# EasyEDA Pro project ProPrj_主车电路板.epro, board PCB1
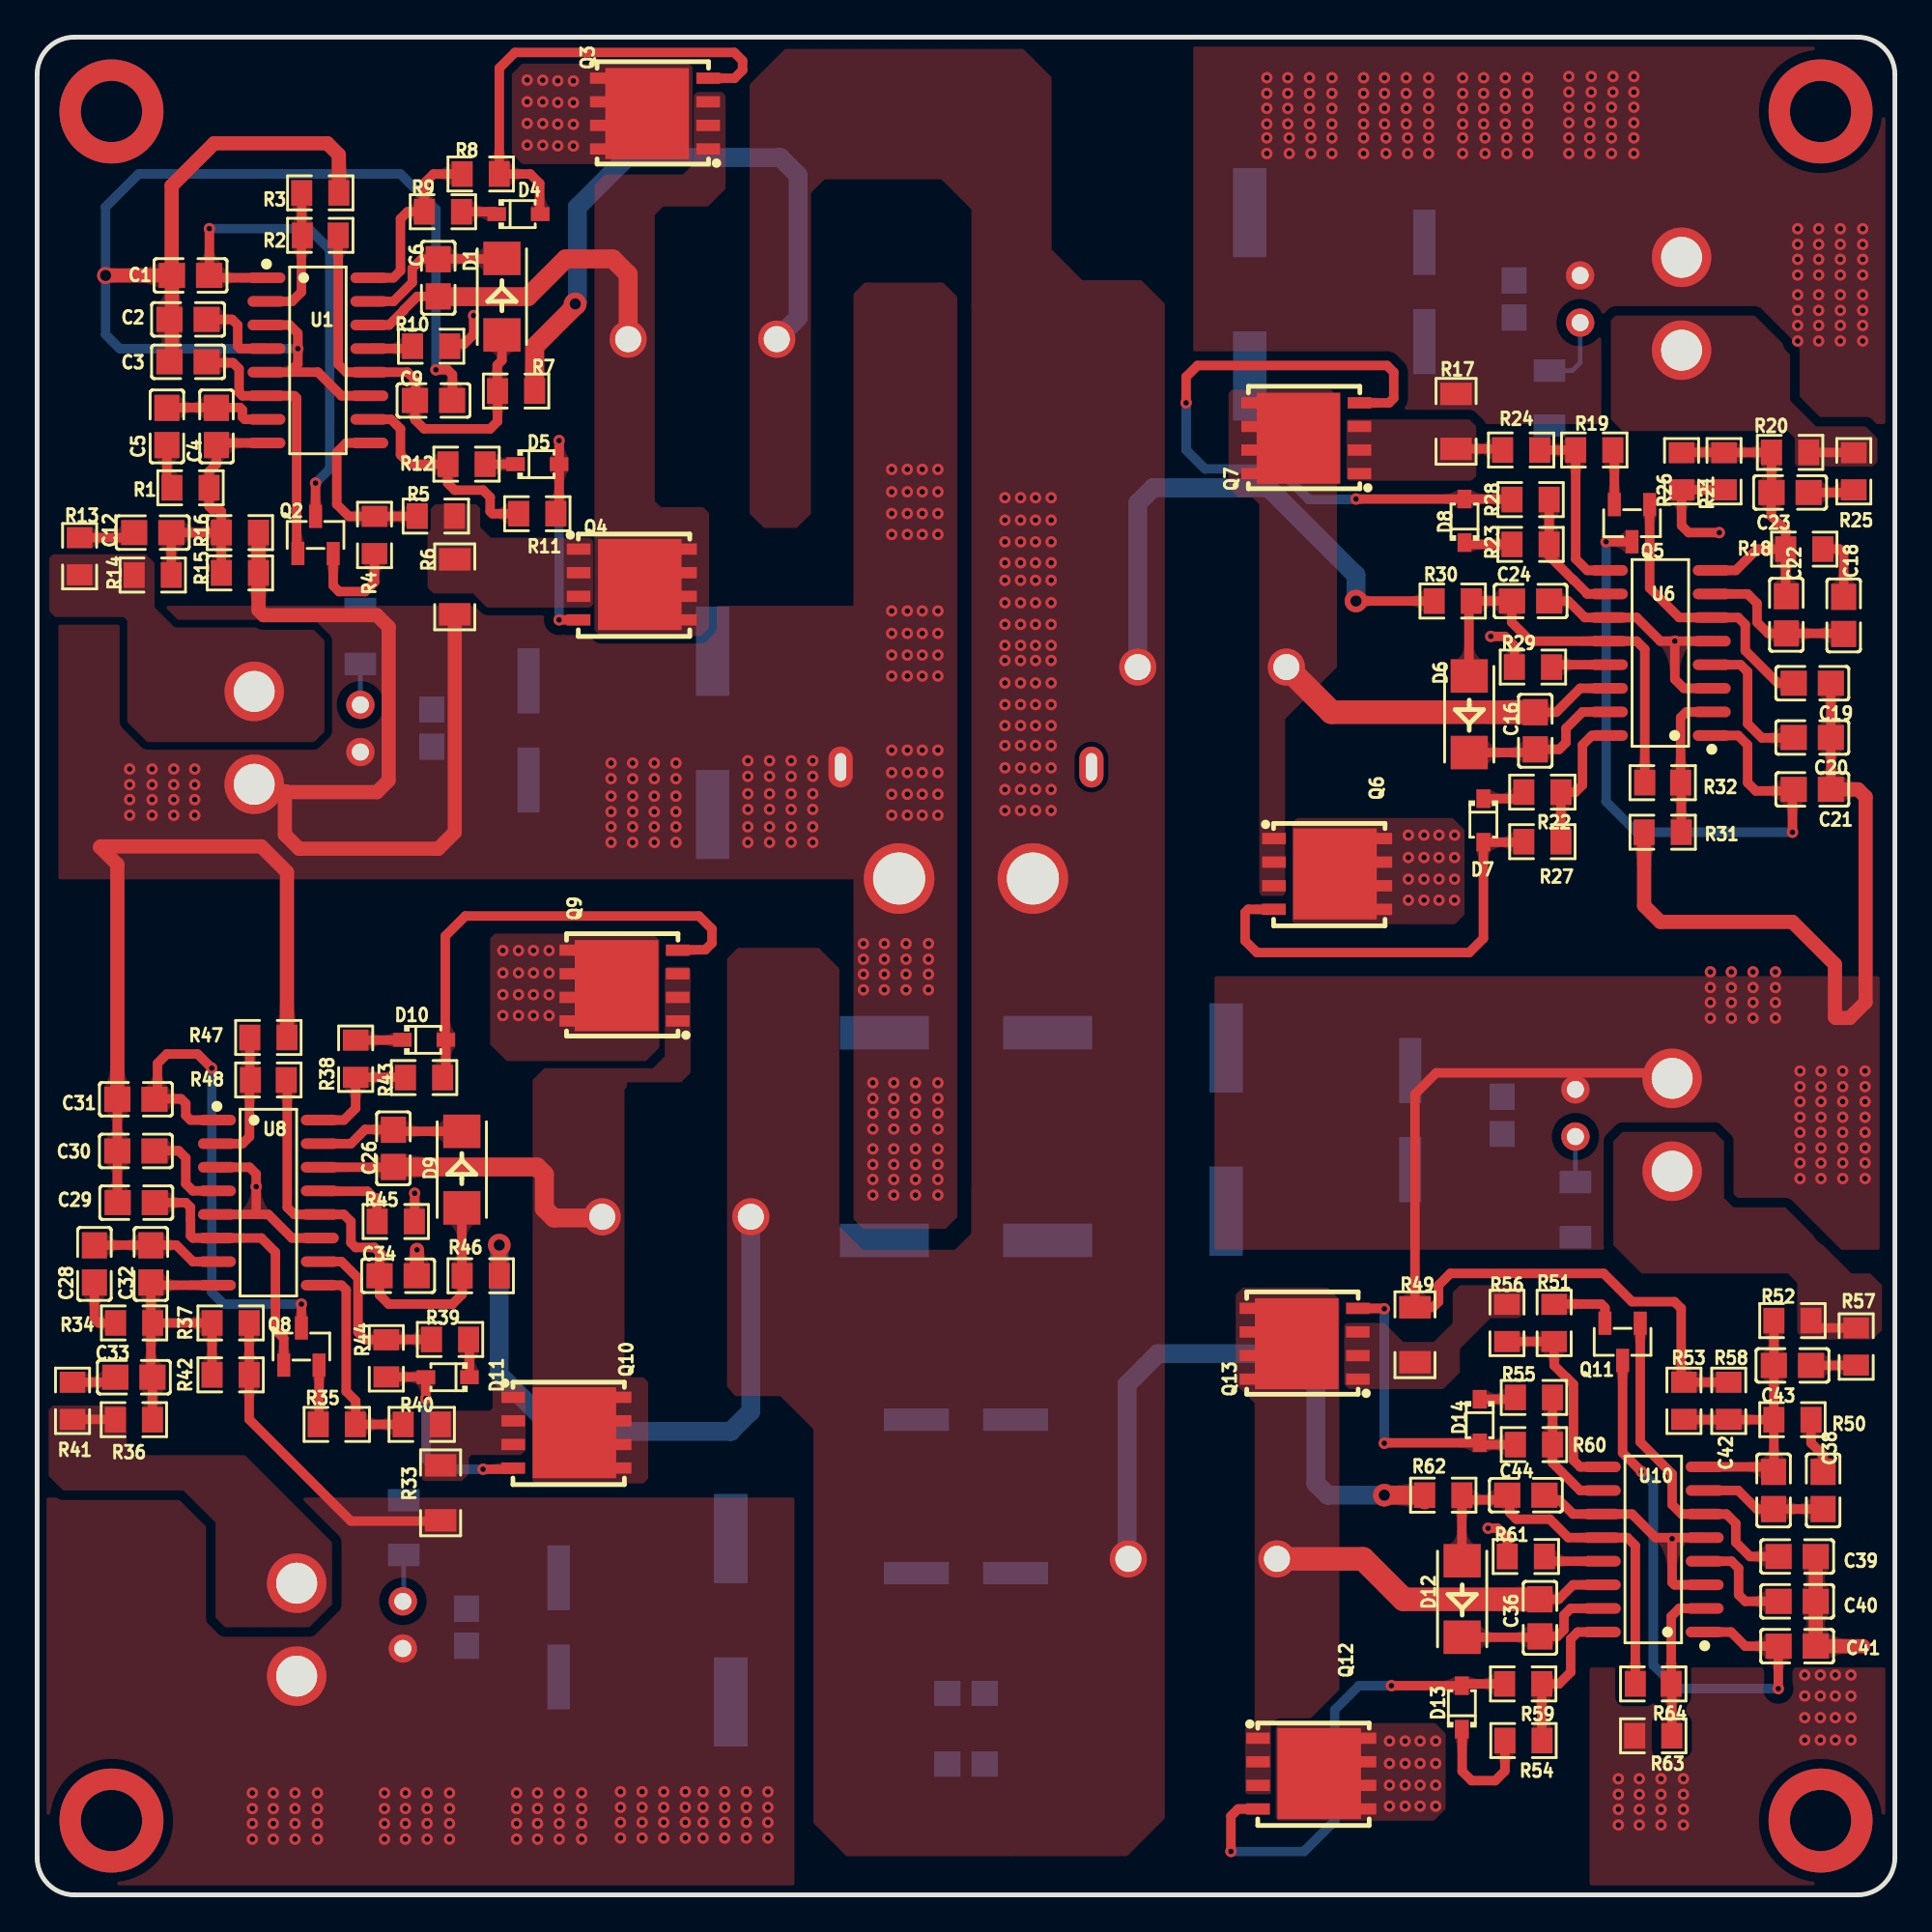
[diagram p3: board, top side]
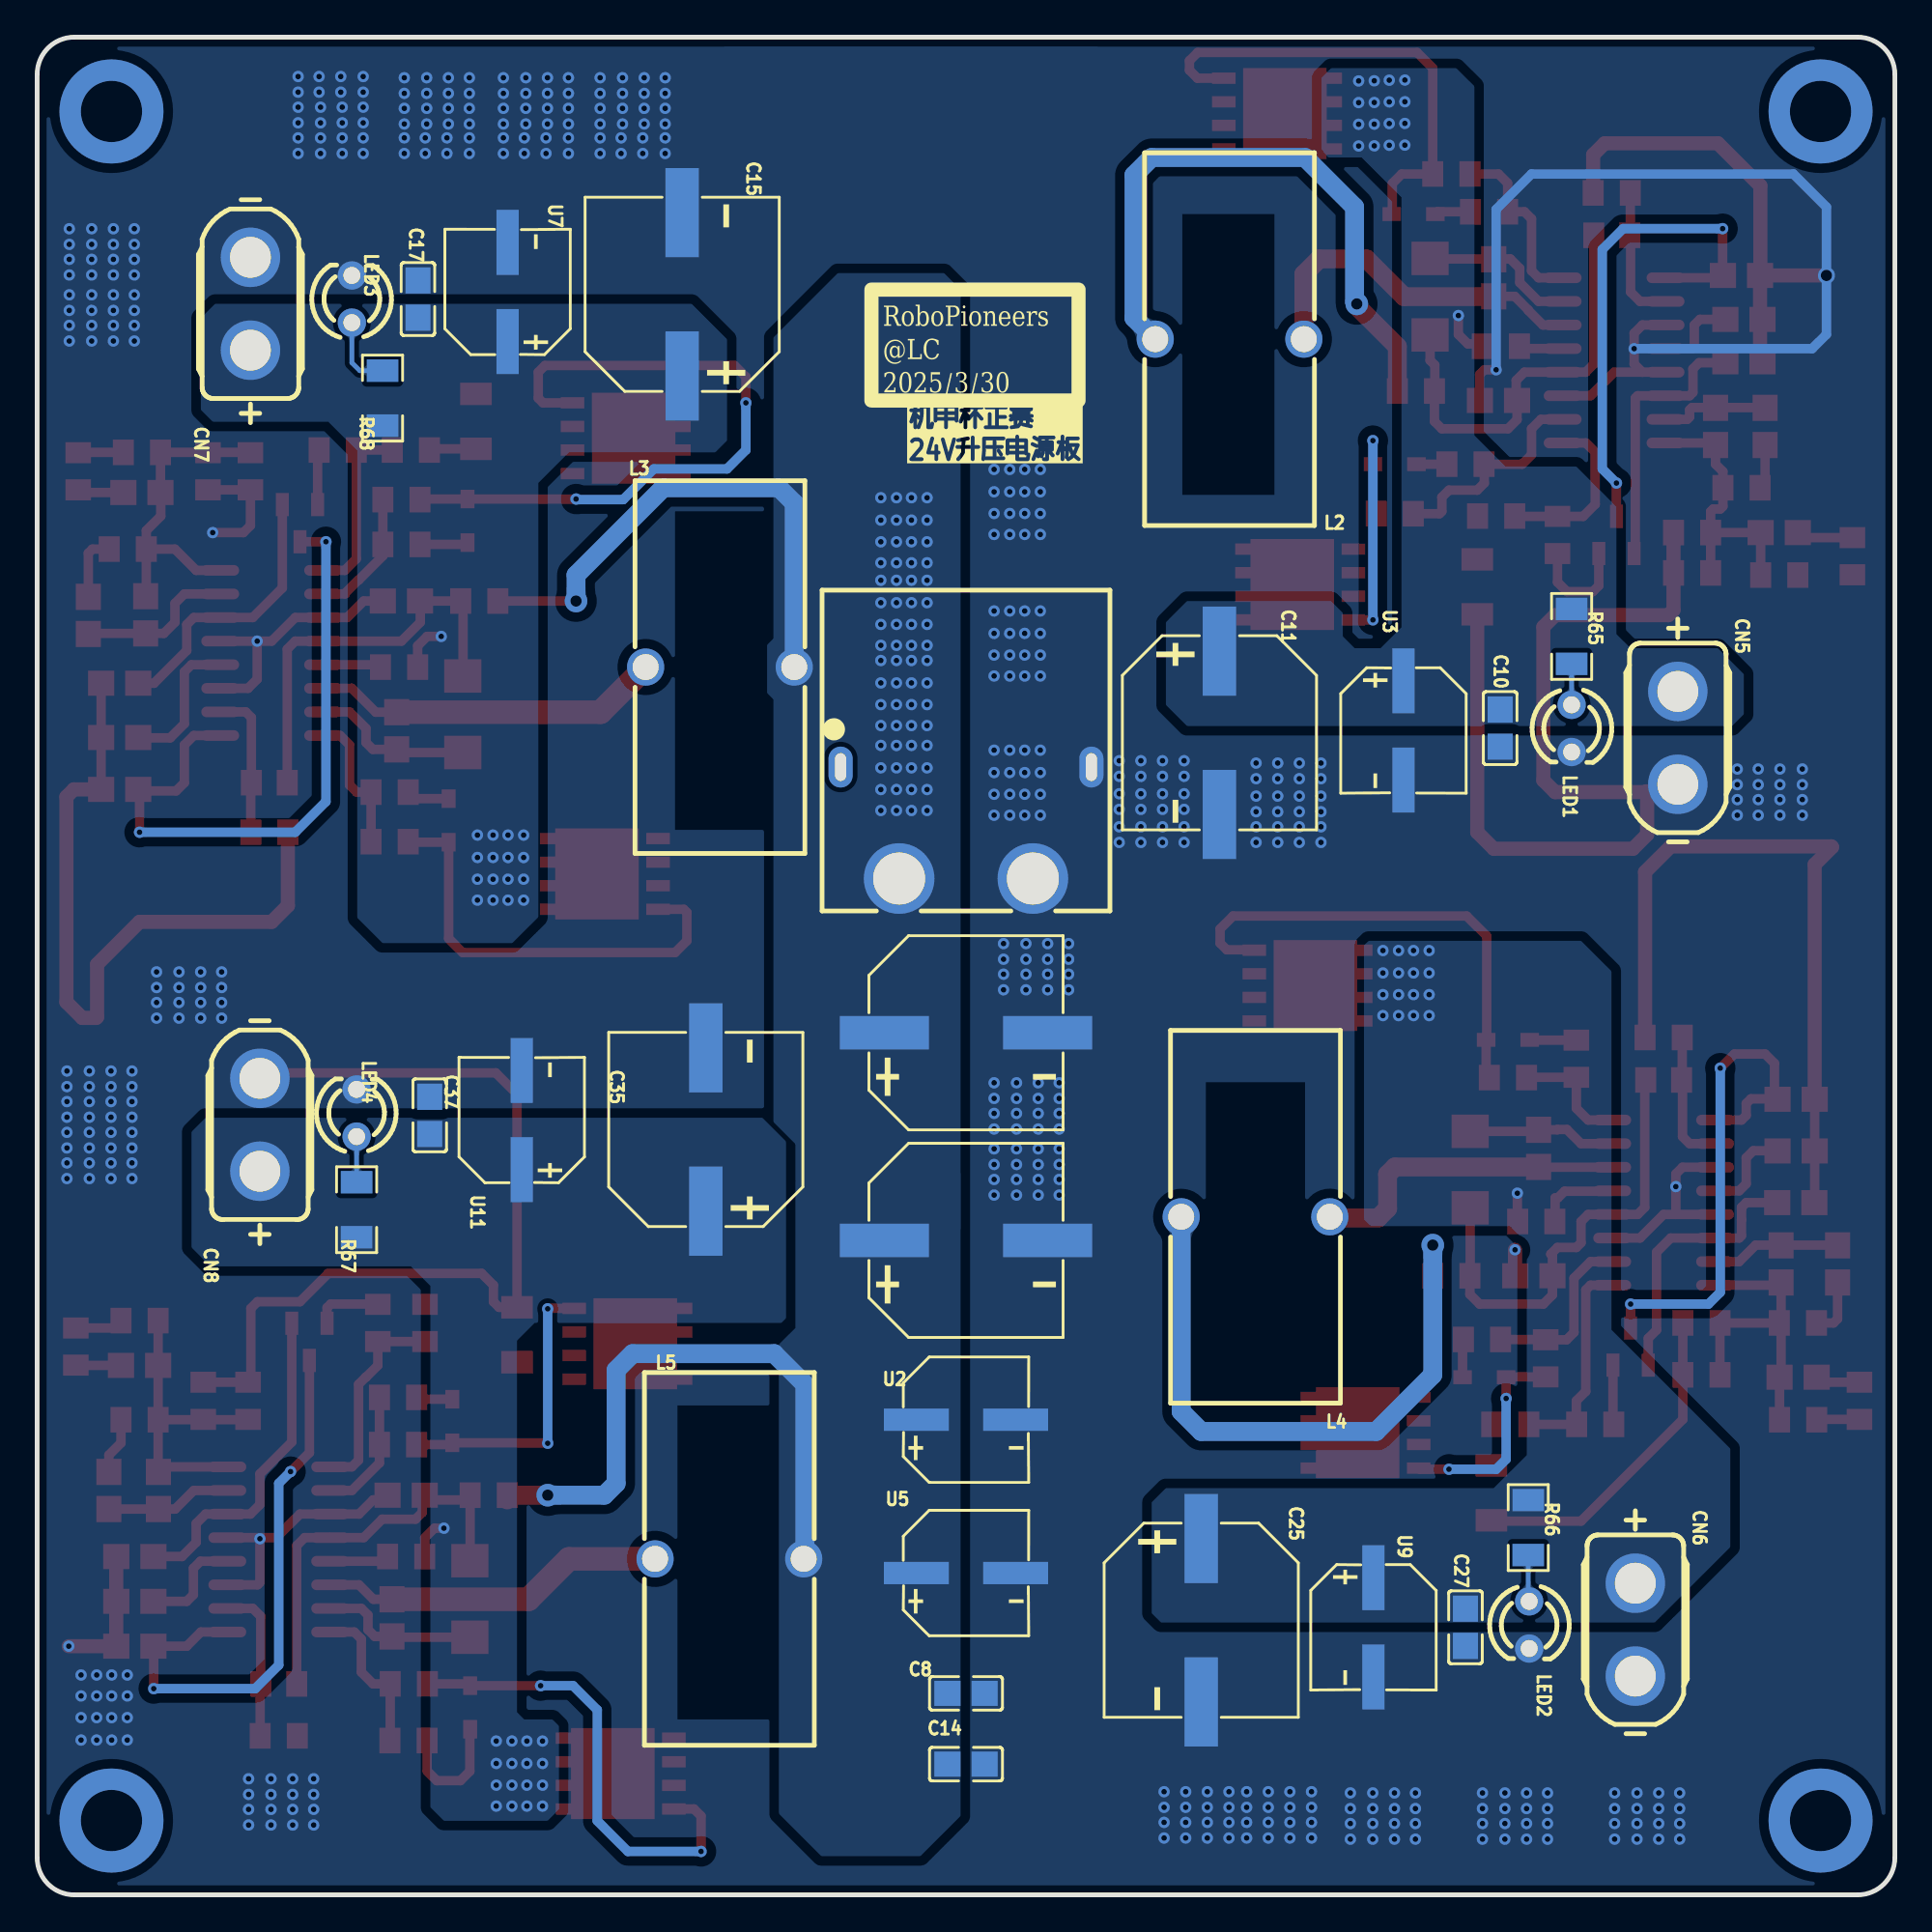
[diagram p4: board, bottom side, seen from below]

Outline 100 x 100 mm; copper layers: Top Layer, Bottom Layer. Coordinates in mm from the lower left corner of the outline.
Outline path: 0,98 0,2 arc(0.59,0.59) 2,0 98,0 arc(99.41,0.59) 100,2 100,98 arc(99.41,99.41) 98,100 2,100 arc(0.59,99.41) 0,98
Stack: Top Layer 0.035mm / Dielectric1 1.51mm FR4 er 4.5 / Bottom Layer 0.035mm

## Design rules (mm)
template: 自定义配置
spacing copperThickness1oz (default): track to track 0.102, other pairs 0.152 to 0.3
spacing copperThickness2oz: track to track 0.203, other pairs 0.152 to 0.3
track width copperThickness1oz (default): min 0.127, default 0.254, max 2.54
track width copperThickness2oz: min 0.203, default 0.254, max 2.54
differential pair differentialPair (default): width min 0.127, default 0.254, max 2.54; gap min 0.152, default 0.152
via viaSize (default): diameter min 0.5, default 0.61, max 10; hole min 0.3, default 0.305, max 6.299
net GND uses copperRegion2
net $1N1198 uses copperRegion1
net +16.8V uses copperRegion1
net $1N2454 uses copperRegion1
net VOUT1 uses copperRegion1
net VOUT3 uses copperRegion1
net $1N10505 uses copperRegion1
net VOUT2 uses copperRegion1
net $1N12147 uses copperRegion1
net VOUT4 uses copperRegion1
net $1N13780 uses copperRegion1
net $1N10518 uses copperRegion1
net $1N10542 uses copperRegion1
net $1N12190 uses copperRegion1
net $1N13823 uses copperRegion1

## Placement (name value [footprint] x y rotation side)
C1  100nF  [C0805]  8.25 87.17 0 top
C2  100pF  [C0805]  8.12 84.81 0 top
C3  270pF  [C0805]  8.12 82.52 0 top
C4  1nF  [C0805]  9.65 79.05 90 top
C5  10nF  [C0805]  6.98 79.05 90 top
C6  1uF  [C0805]  21.59 87.05 90 top
C7  470uF  [CAP-SMD_BD10.0-L10.3-W10.3-LS11.0-R-RD]  50 46.41 0 bottom
C8  1uF  [C0805]  50 10.85 0 bottom
C9  10uF  [C0805]  21.34 80.44 180 top
C10  1uF  [C0805]  21.24 62.81 90 bottom
C11  470uF  [CAP-SMD_BD10.0-L10.3-W10.3-LS11.0-R-RD]  36.36 62.55 90 bottom
C12  1nF  [C0805]  6.22 73.33 180 top
C13  470uF  [CAP-SMD_BD10.0-L10.3-W10.3-LS11.0-R-RD]  50 35.23 0 bottom
C14  1uF  [C0805]  50 7.04 0 bottom
C15  470uF  [CAP-SMD_BD10.0-L10.3-W10.3-LS11.0-R-RD]  65.28 86.16 270 bottom
C16  1uF  [C0805]  80.65 62.66 270 top
C17  1uF  [C0805]  79.5 85.9 270 bottom
C18  10nF  [C0805]  97.25 68.87 270 top
C19  270pF  [C0805]  95.56 65.22 180 top
C20  100pF  [C0805]  95.56 62.3 180 top
C21  100nF  [C0805]  95.56 59.51 180 top
C22  1nF  [C0805]  94.16 68.9 270 top
C23  1nF  [C0805]  94.36 75.49 0 top
C24  10uF  [C0805]  80.39 69.65 180 top
C25  470uF  [CAP-SMD_BD10.0-L10.3-W10.3-LS11.0-R-RD]  37.34 14.78 90 bottom
C26  1uF  [C0805]  19.18 40.18 90 top
C27  1uF  [C0805]  23.11 14.4 90 bottom
C28  10nF  [C0805]  3.08 33.96 90 top
C29  270pF  [C0805]  5.33 37.26 0 top
C30  100pF  [C0805]  5.31 40.04 0 top
C31  100nF  [C0805]  5.31 42.83 0 top
C32  1nF  [C0805]  6.12 33.96 90 top
C33  1nF  [C0805]  5.21 27.86 180 top
C34  10uF  [C0805]  19.43 33.33 180 top
C35  470uF  [CAP-SMD_BD10.0-L10.3-W10.3-LS11.0-R-RD]  64.01 41.2 270 bottom
C36  1uF  [C0805]  80.9 14.91 270 top
C37  1uF  [C0805]  78.87 41.96 270 bottom
C38  10nF  [C0805]  96.14 21.77 270 top
C39  270pF  [C0805]  94.74 18.21 180 top
C40  100pF  [C0805]  94.74 15.8 180 top
C41  100nF  [C0805]  94.74 13.39 180 top
C42  1nF  [C0805]  93.47 21.77 270 top
C43  1nF  [C0805]  94.49 28.5 0 top
C44  10uF  [C0805]  80.14 21.51 180 top
CN5  XT30UPB-F30.G.Y  [CONN-TH_XT30UPB-F]  11.68 62.28 270 bottom
CN6  XT30UPB-F30.G.Y  [CONN-TH_XT30UPB-F]  13.97 14.28 270 bottom
CN7  XT30UPB-F30.G.Y  [CONN-TH_XT30UPB-F]  88.52 85.65 90 bottom
CN8  XT30UPB-F30.G.Y  [CONN-TH_XT30UPB-F]  88.01 41.45 90 bottom
D1  SS14  [DO-214AC_L5.0-W2.5-LS5.0-FD]  25.02 86.03 90 top
D4  1N4148WS-E  [SOD-323_L1.8-W1.3-LS2.5-RD]  25.91 90.47 0 top
D5  1N4148WS-E  [SOD-323_L1.8-W1.3-LS2.5-RD]  26.92 77.01 0 top
D6  SS14  [DO-214AC_L5.0-W2.5-LS5.0-FD]  77.09 63.55 270 top
D7  1N4148WS-E  [SOD-323_L1.8-W1.3-LS2.5-RD]  77.85 57.84 270 top
D8  1N4148WS-E  [SOD-323_L1.8-W1.3-LS2.5-RD]  76.84 73.97 90 top
D9  SS14  [DO-214AC_L5.0-W2.5-LS5.0-FD]  22.86 39.04 90 top
D10  1N4148WS-E  [SOD-323_L1.8-W1.3-LS2.5-RD]  20.83 46.03 0 top
D11  1N4148WS-E  [SOD-323_L1.8-W1.3-LS2.5-RD]  22.1 27.86 180 top
D12  SS14  [DO-214AC_L5.0-W2.5-LS5.0-FD]  76.71 15.93 270 top
D13  1N4148WS-E  [SOD-323_L1.8-W1.3-LS2.5-RD]  76.69 10.09 90 top
D14  1N4148WS-E  [SOD-323_L1.8-W1.3-LS2.5-RD]  77.65 25.51 270 top
L2  47uH  [IND-TH_L20.0-W9.0-P8.00-D1.0]  35.81 83.74 0 bottom
L3  47uH  [IND-TH_L20.0-W9.0-P8.00-D1.0]  63.25 66.09 180 bottom
L4  47uH  [IND-TH_L20.0-W9.0-P8.00-D1.0]  34.42 36.5 0 bottom
L5  47uH  [IND-TH_L20.0-W9.0-P8.00-D1.0]  62.74 18.09 180 bottom
LED1  -  [LED_TH-3mm]  17.4 62.79 270 bottom
LED2  -  [LED_TH-3mm]  19.69 14.53 270 bottom
LED3  -  [LED_TH-3mm]  83.06 85.9 90 bottom
LED4  -  [LED_TH-3mm]  82.8 42.09 90 bottom
Q2  S8050/J3Y/0.4  [SOT-23-3_L2.9-W1.3-P1.90-LS2.4-BR]  14.99 73.2 270 top
Q3  HXY50N04NF  [PDFN-8_L6.0-W5.0-P1.27-BL-A]  33.27 95.89 90 top
Q4  HXY50N04NF  [PDFN-8_L6.0-W5.0-P1.27-BL-A]  32 70.54 270 top
Q5  S8050/J3Y/0.4  [SOT-23-3_L2.9-W1.3-P1.90-LS2.4-BR]  85.85 73.84 90 top
Q6  HXY50N04NF  [PDFN-8_L6.0-W5.0-P1.27-BL-A]  69.43 54.96 270 top
Q7  HXY50N04NF  [PDFN-8_L6.0-W5.0-P1.27-BL-A]  68.33 78.41 90 top
Q8  S8050/J3Y/0.4  [SOT-23-3_L2.9-W1.3-P1.90-LS2.4-BR]  14.22 29.51 270 top
Q9  HXY50N04NF  [PDFN-8_L6.0-W5.0-P1.27-BL-A]  31.62 48.95 90 top
Q10  HXY50N04NF  [PDFN-8_L6.0-W5.0-P1.27-BL-A]  28.49 24.88 270 top
Q11  S8050/J3Y/0.4  [SOT-23-3_L2.9-W1.3-P1.90-LS2.4-BR]  85.34 29.77 90 top
Q12  HXY50N04NF  [PDFN-8_L6.0-W5.0-P1.27-BL-A]  68.58 6.53 270 top
Q13  HXY50N04NF  [PDFN-8_L6.0-W5.0-P1.27-BL-A]  68.24 29.66 90 top
R1  47kΩ  [R0805]  8.25 75.74 0 top
R2  100kΩ  [R0805_NEW]  15.24 89.33 0 top
R3  20kΩ  [R0805]  15.24 91.62 180 top
R4  200kΩ  [R0805]  18.16 73.2 90 top
R5  10kΩ  [R0805]  21.46 74.22 0 top
R6  3mΩ  [R1206]  22.48 70.41 90 top
R7  10Ω  [R0805]  25.78 80.95 0 top
R8  15Ω  [R0805]  23.88 92.63 0 top
R9  2Ω  [R0805]  21.84 90.6 0 top
R10  51kΩ  [R0805]  21.21 83.36 0 top
R11  15Ω  [R0805]  26.92 74.35 0 top
R12  2Ω  [R0805]  23.11 77.01 0 top
R13  10kΩ  [R0805]  2.29 72.06 270 top
R14  200kΩ  [R0805]  6.22 71.04 180 top
R15  10kΩ  [R0805]  10.92 71.16 180 top
R16  200kΩ  [R0805]  10.92 73.33 180 top
R17  3mΩ  [R1206]  76.38 79.32 270 top
R18  47kΩ  [R0805]  95.12 72.44 180 top
R19  200kΩ  [R0805]  83.82 77.78 180 top
R20  200kΩ  [R0805]  94.36 77.65 0 top
R21  200kΩ  [R0805]  90.81 76.63 90 top
R22  2Ω  [R0805]  81.03 59.36 180 top
R23  2Ω  [R0805]  80.39 72.69 180 top
R24  10kΩ  [R0805]  79.88 77.78 180 top
R25  10kΩ  [R0805]  97.79 76.63 90 top
R26  10kΩ  [R0805]  88.52 76.63 90 top
R27  15Ω  [R0805]  81.03 56.69 180 top
R28  15Ω  [R0805]  80.39 75.11 180 top
R29  51kΩ  [R0805]  80.52 66.09 180 top
R30  10Ω  [R0805]  76.2 69.65 180 top
R31  20kΩ  [R0805]  87.5 57.2 0 top
R32  100kΩ  [R0805_NEW]  87.5 59.87 180 top
R33  3mΩ  [R1206]  21.72 21.64 90 top
R34  47kΩ  [R0805]  5.22 30.78 0 top
R35  200kΩ  [R0805]  16.13 25.32 0 top
R36  200kΩ  [R0805]  5.21 25.58 180 top
R37  200kΩ  [R0805]  10.41 30.78 180 top
R38  2Ω  [R0805]  17.14 45.01 90 top
R39  2Ω  [R0805]  22.22 29.9 0 top
R40  10kΩ  [R0805]  20.7 25.32 0 top
R41  10kΩ  [R0805]  1.91 26.59 270 top
R42  10kΩ  [R0805]  10.41 27.99 180 top
R43  15Ω  [R0805]  20.83 43.99 0 top
R44  15Ω  [R0805]  18.8 28.88 270 top
R45  51kΩ  [R0805]  19.3 36.25 0 top
R46  10Ω  [R0805]  23.88 33.33 0 top
R47  20kΩ  [R0805]  12.45 46.15 180 top
R48  100kΩ  [R0805_NEW]  12.45 43.87 0 top
R49  3mΩ  [R1206]  74.17 30.15 270 top
R50  47kΩ  [R0805]  94.49 25.58 180 top
R51  200kΩ  [R0805]  81.66 30.78 270 top
R52  200kΩ  [R0805]  94.49 30.91 0 top
R53  200kΩ  [R0805]  88.65 26.59 270 top
R54  2Ω  [R0805]  80.01 8.31 180 top
R55  2Ω  [R0805]  80.57 26.78 180 top
R56  10kΩ  [R0805]  79.12 30.78 90 top
R57  10kΩ  [R0805]  97.92 29.51 90 top
R58  10kΩ  [R0805]  91.06 26.59 270 top
R59  15Ω  [R0805]  79.99 11.36 180 top
R60  15Ω  [R0805]  80.57 24.24 180 top
R61  51kΩ  [R0805]  80.14 18.21 180 top
R62  10Ω  [R0805]  75.69 21.51 180 top
R63  20kΩ  [R0805]  87 8.56 0 top
R64  100kΩ  [R0805_NEW]  87 11.35 180 top
R65  10kΩ  [R1206]  17.4 67.74 270 bottom
R66  10kΩ  [R1206]  19.73 19.77 270 bottom
R67  10kΩ  [R1206]  82.8 36.88 90 bottom
R68  10kΩ  [R1206]  81.41 80.57 90 bottom
U1  EG1164  [SOP-16_L9.9-W3.9-P1.27-LS6.0-BL]  15.11 82.6 270 top
U2  100uF  [CAP-SMD_BD6.3-L6.6-W6.6-LS7.2-FD]  50 25.58 180 bottom
U3  100uF  [CAP-SMD_BD6.3-L6.6-W6.6-LS7.2-FD]  26.45 62.68 270 bottom
U4  XT60PW-F  [TH_2P-XT60PW-F]  50 57.71 180 bottom
U5  100uF  [CAP-SMD_BD6.3-L6.6-W6.6-LS7.2-FD]  50 17.32 180 bottom
U6  EG1164  [SOP-16_L9.9-W3.9-P1.27-LS6.0-BL]  87.38 66.85 90 top
U7  100uF  [CAP-SMD_BD6.3-L6.6-W6.6-LS7.2-FD]  74.68 86.28 90 bottom
U8  EG1164  [SOP-16_L9.9-W3.9-P1.27-LS6.0-BL]  12.45 37.26 270 top
U9  100uF  [CAP-SMD_BD6.3-L6.6-W6.6-LS7.2-FD]  28.07 14.4 270 bottom
U10  EG1164  [SOP-16_L9.9-W3.9-P1.27-LS6.0-BL]  87 18.59 90 top
U11  100uF  [CAP-SMD_BD6.3-L6.6-W6.6-LS7.2-FD]  73.91 41.71 90 bottom

## Footprints (pads in the part's own frame, mm; a bottom-side part is the same pattern mirrored in y, then rotated)
C0805
  rect 1.41x1.35 smd: 1(-1,0) 2(1,0)
CAP-SMD_BD6.3-L6.6-W6.6-LS7.2-FD
  rect 3.5x1.2 smd: 1(-2.67,0) 2(2.67,0)
CAP-SMD_BD10.0-L10.3-W10.3-LS11.0-R-RD
  rect 4.8x1.8 smd: 1(4.395,0) 2(-4.395,0)
CONN-TH_XT30UPB-F
  round 3.2 hole 2.2: 1(-2.5,0) 2(2.5,0)
DO-214AC_L5.0-W2.5-LS5.0-FD
  rect 1.8x2 smd: 1(-2.06,0) 2(2.06,0)
IND-TH_L20.0-W9.0-P8.00-D1.0
  round 2 hole 1.4: 1(-4,0) 2(4,0)
LED_TH-3mm
  round 1.524 hole 0.914: 1(-1.27,0) 2(1.27,0)
PDFN-8_L6.0-W5.0-P1.27-BL-A
  rect 0.61x1.27 smd: 1(-1.905,-2.856) 2(-0.635,-2.856) 3(0.635,-2.856) 4(1.905,-2.856)
  rect 0.61x1.3 smd: 5(1.905,2.856) 6(0.635,2.856) 7(-0.635,2.856) 8(-1.905,2.856)
  rect 4.9x4.5 smd: 8(0,0.433)
R0805
  rect 1.133x1.377 smd: 1(-1,0) 2(1,0)
R0805_NEW
  rect 1.133x1.377 smd: 1(-0.966,0) 2(0.966,0)
R1206
  rect 1.208x1.701 smd: 1(-1.479,0) 2(1.479,0)
SOD-323_L1.8-W1.3-LS2.5-RD
  rect 1x0.75 smd: 1(-1.173,0) 2(1.173,0)
SOP-16_L9.9-W3.9-P1.27-LS6.0-BL
  oval 0.574x2.038 smd: 1(-4.445,-2.769) 2(-3.175,-2.769) 3(-1.905,-2.769) 4(-0.635,-2.769) 5(0.635,-2.769) 6(1.905,-2.769) 7(3.175,-2.769) 8(4.445,-2.769) 9(4.445,2.769) 10(3.175,2.769) 11(1.905,2.769) 12(0.635,2.769) 13(-0.635,2.769) 14(-1.905,2.769) 15(-3.175,2.769) 16(-4.445,2.769)
SOT-23-3_L2.9-W1.3-P1.90-LS2.4-BR
  rect 1.25x0.7 smd: 1(1,-0.95) 2(1,0.95) 3(-1,0)
TH_2P-XT60PW-F
  oval 1.3x2.2 hole 0.6x1.5: 1(-6.75,3) 2(6.75,3)
  round 3.8 hole 2.8: 3(-3.6,-3) 4(3.6,-3)

## Nets
As in the schematic.

Pads without a net: U4 1

## Via types
v1: diameter 5.6, hole 3.3, Top Layer to Bottom Layer, 4 vias
v2: diameter 0.61, hole 0.305, Top Layer to Bottom Layer, 606 vias
v3: diameter 0.914, hole 0.61, Top Layer to Bottom Layer, 1 via
v4: diameter 1.219, hole 0.61, Top Layer to Bottom Layer, 4 vias

## Routing (per net, layer and track width the routed paths; a pad name or vN(x,y) marks a point on that pad's centre or on a via; arc(x,y) is an arc through that point)
+3.3V: length 27.3
  Top Layer w0.508: U1.1 9.38,87.05 C1.2 9.27,87.19 v2(9.27,89.69) ; Q2.3 v2(14.99,76)
  Bottom Layer w0.508: v2(14.99,76) 15.75,76.76 15.75,88.57 14.63,89.69 v2(9.27,89.69)
+16.8V: length 129.3
  Top Layer w0.508: v4(70.99,69.65) R30.2
  Top Layer w0.762: R46.2 v4(24.88,34.98)
  Top Layer w1.016: v4(72.52,21.51) 74.44,21.51 74.69,21.26 ; v4(28.96,85.64) 28.96,85.53 26.78,83.35 R7.2
  Bottom Layer w1.016: L4.2 38.42,26.02 37.34,24.94 27.92,24.94 24.88,27.99 v4(24.88,34.98) ; v4(70.99,69.65) 70.99,71.04 66.29,75.74 60.07,75.74 59.25,74.92 L3.2 ; L5.2 58.67,18.15 58.67,27.48 60.32,29.13 67.94,29.13 68.83,28.25 68.83,22.15 69.47,21.51 v4(72.52,21.51) ; L2.2 40.96,84.89 40.96,92.57 40,93.52 31.75,93.52 29.08,90.86 29.08,85.76 v4(28.96,85.64)
  vias: v2(52.1,75.21) v2(52.1,74) v2(52.1,72.83) v2(52.1,71.71) v2(52.1,70.76) v2(52.1,69.56) v2(52.1,68.39) v2(52.1,67.26) v2(52.1,66.44) v2(52.1,65.24) v2(52.1,64.07) v2(52.1,62.94) v2(52.1,61.87) v2(52.1,60.67) v2(52.1,59.5) v2(52.1,58.37) v2(52.94,75.21) v2(52.94,74) v2(52.94,72.83) v2(52.94,71.71) v2(52.94,70.76) v2(52.94,69.56) v2(52.94,68.39) v2(52.94,67.26) v2(52.94,66.44) v2(52.94,65.24) v2(52.94,64.07) v2(52.94,62.94) v2(52.94,61.87) v2(52.94,60.67) v2(52.94,59.5) v2(52.94,58.37) v2(53.74,75.21) v2(53.74,74) v2(53.74,72.83) v2(53.74,71.71) v2(53.74,70.76) v2(53.74,69.56) v2(53.74,68.39) v2(53.74,67.26) v2(53.74,66.44) v2(53.74,65.24) v2(53.74,64.07) v2(53.74,62.94) v2(53.74,61.87) v2(53.74,60.67) v2(53.74,59.5) v2(53.74,58.37) v2(54.58,75.21) v2(54.58,74) v2(54.58,72.83) v2(54.58,71.71) v2(54.58,70.76) v2(54.58,69.56) v2(54.58,68.39) v2(54.58,67.26) v2(54.58,66.44) v2(54.58,65.24) v2(54.58,64.07) v2(54.58,62.94) v2(54.58,61.87) v2(54.58,60.67) v2(54.58,59.5) v2(54.58,58.37)
GND: length 329.8
  Top Layer w0.508: 87.95,19.23 U10.5 ; 87.95,19.23 v2(88.01,19.17) 88.01,16.81 88.14,16.69 U10.3 ; 87.95,19.23 87.12,19.23 85.85,20.5 U10.11 82.68,20.5 81.91,21.26 81.14,21.26 ; 13.59,81.97 U1.5 ; 13.59,81.97 15.11,81.97 16.38,80.7 U1.11 ; 13.59,81.97 14.03,82.41 v2(14.03,83.23) 14.03,84.06 13.59,84.51 U1.3 ; C21.1 C20.1 C19.1 ; 86.82,44.21 86.78,44.25 75.31,44.25 74.17,43.1 74.17,31.63 75.14,31.63 75.44,31.93 75.44,32.82 76.07,33.45 84.33,33.45 85.85,31.93 88.14,31.93 88.5,31.57 88.5,27.74 R53.1 R58.1 ; R21.1 R26.1 88.52,73.71 88.9,73.33 v2(90.55,73.33) ; C9.1 22.35,80.46 22.35,81.84 22.1,82.09 v2(21.46,82.09) ; v2(88.16,67.49) 87.38,67.49 86.11,68.76 U6.11 83.31,68.76 82.42,69.65 C24.1 ; v2(88.16,67.49) 88.16,65.44 88.65,64.95 U6.3 ; v2(88.16,67.49) U6.5 ; R37.1 R42.1 11.41,25.59 16.89,20.12 21.67,20.12 R33.1 ; U8.3 11.43,39.17 11.79,38.81 v2(11.79,38.12) 11.79,36.64 11.81,36.63 ; C31.1 C30.1 4.31,37.28 C29.1 ; U8.11 13.72,35.36 12.45,36.63 11.81,36.63 ; 11.81,36.63 U8.5
  Top Layer w0.762: R3.1 16.24,93.67 15.62,94.28 9.53,94.28 7.24,92 7.24,87.19 C1.1 ; v2(98.3,13.39) C41.1 C40.1 C39.1 ; C31.1 4.31,55.47 3.38,56.4 3.42,56.44 12.06,56.44 13.45,55.06 R47.1 ; C1.1 7.25,82.65 C3.1 ; C1.1 v3(3.68,87.17) ; R16.1 R15.1 11.92,69.16 12.19,68.89 18.29,68.89 18.92,68.25 18.92,60 18.29,59.36 13.42,59.36 13.38,59.4 13.33,59.35 13.33,57.07 14.1,56.31 21.59,56.31 22.48,57.2 R6.1 ; v2(20.45,34.72) 20.45,33.34 C34.1 ; C21.1 98.02,59.51 98.43,59.11 98.43,48.06 97.57,47.21 96.82,47.21 96.77,47.25 96.77,50.09 94.49,52.38 87.38,52.38 86.5,53.25 R31.1
  Bottom Layer w0.508: v2(21.46,82.09) 21.46,90.73 19.56,92.63 5.46,92.63 3.68,90.86 v3(3.68,87.17) 3.68,84 4.45,83.23 v2(14.03,83.23)
  vias: v2(4.98,60.6) v2(4.98,59.76) v2(4.98,58.96) v2(4.98,58.12) v2(6.19,60.6) v2(6.19,59.76) v2(6.19,58.96) v2(6.19,58.12) v2(7.35,60.6) v2(7.35,59.76) v2(7.35,58.96) v2(7.35,58.12) v2(8.48,60.6) v2(8.48,59.76) v2(8.48,58.96) v2(8.48,58.12) v2(11.58,5.49) v2(11.58,4.65) v2(11.58,3.84) v2(11.58,3) v2(12.71,5.49) v2(12.71,4.65) v2(12.71,3.84) v2(12.71,3) v2(13.88,5.49) v2(13.88,4.65) v2(13.88,3.84) v2(13.88,3) v2(15.09,5.49) v2(15.09,4.65) v2(15.09,3.84) v2(15.09,3) v2(18.7,5.49) v2(18.7,4.65) v2(18.7,3.84) v2(18.7,3) v2(19.82,5.49) v2(19.82,4.65) v2(19.82,3.84) v2(19.82,3) v2(20.99,5.49) v2(20.99,4.65) v2(20.99,3.84) v2(20.99,3) v2(22.2,5.49) v2(22.2,4.65) v2(22.2,3.84) v2(22.2,3) v2(25.81,5.49) v2(25.81,4.65) v2(25.81,3.84) v2(25.81,3) v2(26.94,5.49) v2(26.94,4.65) v2(26.94,3.84) v2(26.94,3) v2(28.1,5.49) v2(28.1,4.65) v2(28.1,3.84) v2(28.1,3) v2(29.31,5.49) v2(29.31,4.65) v2(29.31,3.84) v2(29.31,3) v2(30.89,60.92) v2(30.89,60.08) v2(30.89,59.15) v2(30.89,58.3) v2(30.89,57.49) v2(30.89,56.65) v2(31.4,5.55) v2(31.4,4.71) v2(31.4,3.9) v2(31.4,3.06) v2(32.06,60.92) v2(32.06,60.08) v2(32.06,59.15) v2(32.06,58.3) v2(32.06,57.49) v2(32.06,56.65) v2(32.56,5.55) v2(32.56,4.71) v2(32.56,3.9) v2(32.56,3.06) v2(33.22,60.92) v2(33.22,60.08) v2(33.22,59.15) v2(33.22,58.3) v2(33.22,57.49) v2(33.22,56.65) v2(33.73,5.55) v2(33.73,4.71) v2(33.73,3.9) v2(33.73,3.06) v2(34.38,60.92) v2(34.38,60.08) v2(34.38,59.15) v2(34.38,58.3) v2(34.38,57.49) v2(34.38,56.65) v2(34.89,5.55) v2(34.89,4.71) v2(34.89,3.9) v2(34.89,3.06) v2(35.85,5.55) v2(35.85,4.71) v2(35.85,3.9) v2(35.85,3.06) v2(37.01,5.55) v2(37.01,4.71) v2(37.01,3.9) v2(37.01,3.06) v2(38.17,5.55) v2(38.17,4.71) v2(38.17,3.9) v2(38.17,3.06) v2(38.26,61.05) v2(38.26,60.21) v2(38.26,59.27) v2(38.26,58.43) v2(38.26,57.49) v2(38.26,56.65) v2(39.34,5.55) v2(39.34,4.71) v2(39.34,3.9) v2(39.34,3.06) v2(39.42,61.05) v2(39.42,60.21) v2(39.42,59.27) v2(39.42,58.43) v2(39.42,57.49) v2(39.42,56.65) v2(40.59,61.05) v2(40.59,60.21) v2(40.59,59.27) v2(40.59,58.43) v2(40.59,57.49) v2(40.59,56.65) v2(41.75,61.05) v2(41.75,60.21) v2(41.75,59.27) v2(41.75,58.43) v2(41.75,57.49) v2(41.75,56.65) v2(44.48,51.21) v2(44.48,50.36) v2(44.48,49.56) v2(44.48,48.72) v2(44.99,43.71) v2(44.99,42.87) v2(44.99,42.07) v2(44.99,41.22) v2(44.99,40.16) v2(44.99,39.32) v2(44.99,38.51) v2(44.99,37.67) v2(45.6,51.21) v2(45.6,50.36) v2(45.6,49.56) v2(45.6,48.72) v2(46,76.73) v2(46,75.53) v2(46,74.36) v2(46,73.23) v2(46,69.11) v2(46,67.91) v2(46,66.74) v2(46,65.61) v2(46,61.62) v2(46,60.41) v2(46,59.25) v2(46,58.12) v2(46.11,43.71) v2(46.11,42.87) v2(46.11,42.07) v2(46.11,41.22) v2(46.11,40.16) v2(46.11,39.32) v2(46.11,38.51) v2(46.11,37.67) v2(46.84,76.73) v2(46.84,75.53) v2(46.84,74.36) v2(46.84,73.23) v2(46.84,69.11) v2(46.84,67.91) v2(46.84,66.74) v2(46.84,65.61) v2(46.84,61.62) v2(46.84,60.41) v2(46.84,59.25) v2(46.84,58.12) v2(46.77,51.21) v2(46.77,50.36) v2(46.77,49.56) v2(46.77,48.72) v2(47.28,43.71) v2(47.28,42.87) v2(47.28,42.07) v2(47.28,41.22) v2(47.28,40.16) v2(47.28,39.32) v2(47.28,38.51) v2(47.28,37.67) v2(47.65,76.73) v2(47.65,75.53) v2(47.65,74.36) v2(47.65,73.23) v2(47.65,69.11) v2(47.65,67.91) v2(47.65,66.74) v2(47.65,65.61) v2(47.65,61.62) v2(47.65,60.41) v2(47.65,59.25) v2(47.65,58.12) v2(47.98,51.21) v2(47.98,50.36) v2(47.98,49.56) v2(47.98,48.72) v2(48.49,76.73) v2(48.49,75.53) v2(48.49,74.36) v2(48.49,73.23) v2(48.49,69.11) v2(48.49,67.91) v2(48.49,66.74) v2(48.49,65.61) v2(48.49,61.62) v2(48.49,60.41) v2(48.49,59.25) v2(48.49,58.12) v2(48.49,43.71) v2(48.49,42.87) v2(48.49,42.07) v2(48.49,41.22) v2(48.49,40.16) v2(48.49,39.32) v2(48.49,38.51) v2(48.49,37.67) v2(66.19,97.81) v2(66.19,96.97) v2(66.19,96.17) v2(66.19,95.33) v2(66.19,94.58) v2(66.19,93.74) v2(67.32,97.81) v2(67.32,96.97) v2(67.32,96.17) v2(67.32,95.33) v2(67.4,94.58) v2(67.4,93.74) v2(68.49,97.81) v2(68.49,96.97) v2(68.49,96.17) v2(68.49,95.33) v2(68.57,94.58) v2(68.57,93.74) v2(69.7,97.81) v2(69.7,96.97) v2(69.7,96.17) v2(69.7,95.33) v2(69.7,94.58) v2(69.7,93.74) v2(71.4,97.81) v2(71.4,96.97) v2(71.4,96.17) v2(71.4,95.33) v2(71.4,94.58) v2(71.4,93.74) v2(72.53,97.81) v2(72.53,96.97) v2(72.53,96.17) v2(72.53,95.33) v2(72.61,94.58) v2(72.61,93.74) v2(73.7,97.81) v2(73.7,96.97) v2(73.7,96.17) v2(73.7,95.33) v2(73.78,94.58) v2(73.78,93.74) v2(74.9,97.81) v2(74.9,96.97) v2(74.9,96.17) v2(74.9,95.33) v2(74.9,94.58) v2(74.9,93.74) v2(76.74,97.81) v2(76.74,96.97) v2(76.74,96.17) v2(76.74,95.33) v2(76.74,94.58) v2(76.74,93.74) v2(77.86,97.81) v2(77.86,96.97) v2(77.86,96.17) v2(77.86,95.33) v2(77.94,94.58) v2(77.94,93.74) v2(79.03,97.81) v2(79.03,96.97) v2(79.03,96.17) v2(79.03,95.33) v2(79.11,94.58) v2(79.11,93.74) v2(80.24,97.81) v2(80.24,96.97) v2(80.24,96.17) v2(80.24,95.33) v2(80.24,94.58) v2(80.24,93.74) v2(82.45,97.88) v2(82.45,97.04) v2(82.45,96.23) v2(82.45,95.39) v2(82.45,94.58) v2(82.45,93.74) v2(83.58,96.23) v2(83.58,95.39) v2(83.58,94.58) v2(83.58,93.74) v2(83.66,97.88) v2(83.66,97.04) v2(84.75,96.23) v2(84.75,95.39) v2(84.75,94.58) v2(84.75,93.74) v2(84.82,97.88) v2(84.82,97.04) v2(85.12,6.25) v2(85.12,5.41) v2(85.12,4.6) v2(85.12,3.76) v2(85.95,97.88) v2(85.95,97.04) v2(85.95,96.23) v2(85.95,95.39) v2(85.95,94.58) v2(85.95,93.74) v2(86.25,6.25) v2(86.25,5.41) v2(86.25,4.6) v2(86.25,3.76) v2(87.41,6.25) v2(87.41,5.41) v2(87.41,4.6) v2(87.41,3.76) v2(88.62,6.25) v2(88.62,5.41) v2(88.62,4.6) v2(88.62,3.76) v2(90.07,49.68) v2(90.07,48.84) v2(90.07,48.03) v2(90.07,47.19) v2(91.2,49.68) v2(91.2,48.84) v2(91.2,48.03) v2(91.2,47.19) v2(92.37,49.68) v2(92.37,48.84) v2(92.37,48.03) v2(92.37,47.19) v2(93.57,49.68) v2(93.57,48.84) v2(93.57,48.03) v2(93.57,47.19) v2(94.77,89.69) v2(94.77,88.85) v2(94.77,88.04) v2(94.77,87.2) v2(94.77,86.13) v2(94.77,85.29) v2(94.77,84.48) v2(94.77,83.64) v2(94.9,44.35) v2(94.9,43.51) v2(94.9,42.7) v2(94.9,41.86) v2(94.9,41.05) v2(94.9,40.2) v2(94.9,39.4) v2(94.9,38.56) v2(95.15,11.84) v2(95.15,10.71) v2(95.15,9.54) v2(95.15,8.33) v2(95.9,89.69) v2(95.9,88.85) v2(95.9,88.04) v2(95.9,87.2) v2(95.9,86.13) v2(95.9,85.29) v2(95.9,84.48) v2(95.9,83.64) v2(96.02,44.35) v2(96.02,43.51) v2(96.02,42.7) v2(96.02,41.86) v2(96.02,41.05) v2(96.02,40.2) v2(96.02,39.4) v2(96.02,38.56) v2(95.99,11.84) v2(95.99,10.71) v2(95.99,9.54) v2(95.99,8.33) v2(96.8,11.84) v2(96.8,10.71) v2(96.8,9.54) v2(96.8,8.33) v2(97.06,89.69) v2(97.06,88.85) v2(97.06,88.04) v2(97.06,87.2) v2(97.06,86.13) v2(97.06,85.29) v2(97.06,84.48) v2(97.06,83.64) v2(97.19,44.35) v2(97.19,43.51) v2(97.19,42.7) v2(97.19,41.86) v2(97.19,41.05) v2(97.19,40.2) v2(97.19,39.4) v2(97.19,38.56) v2(97.64,11.84) v2(97.64,10.71) v2(97.64,9.54) v2(97.64,8.33) v2(98.27,89.69) v2(98.27,88.85) v2(98.27,88.04) v2(98.27,87.2) v2(98.27,86.13) v2(98.27,85.29) v2(98.27,84.48) v2(98.27,83.64) v2(98.4,44.35) v2(98.4,43.51) v2(98.4,42.7) v2(98.4,41.86) v2(98.4,41.05) v2(98.4,40.2) v2(98.4,39.4) v2(98.4,38.56)
(no net):
  vias: v1(4,96) v1(4,4) v1(96,96) v1(96,4)
REF3.3V-2: length 27.8
  Top Layer w0.508: U8.1 8.25,41.71 8,41.96 8,42.6 7.75,42.85 6.34,42.85 C31.2 ; 6.48,43.1 6.48,44.75 6.98,45.26 8.64,45.26 v2(9.4,44.5) ; Q8.3 v2(14.22,31.8)
  Bottom Layer w0.508: v2(9.4,44.5) 9.4,32.44 10.03,31.8 v2(14.22,31.8)
REF3.3V-3: length 35.2
  Top Layer w0.508: v2(94.49,57.2) 94.49,59.44 ; 94.49,59.44 C21.2 ; 94.49,59.44 94.47,59.42 92.52,59.42 92.07,59.87 92.07,61.9 91.57,62.41 U6.1 ; Q5.3 v2(84.46,72.84)
  Bottom Layer w0.508: v2(84.46,72.84) 84.46,58.85 86.11,57.2 v2(94.49,57.2)
REF3.3V-4: length 30.9
  Top Layer w0.508: Q11.3 85.34,23.8 v2(86.36,22.78) ; v2(93.73,11.1) 93.73,13.37 C41.2 91.95,13.39 91.19,14.15 U10.1
  Bottom Layer w0.508: v2(93.73,11.1) 88.26,11.1 87,12.37 87,22.15 v2(86.36,22.78)
VOUT1: length 2.5
  Top Layer w0.508: 22.21,83.49 22.99,83.49 23.5,84 v2(23.5,85.01)
  vias: v2(26.38,97.69) v2(26.38,96.52) v2(26.38,95.36) v2(26.38,94.19) v2(27.22,97.68) v2(27.22,96.52) v2(27.22,95.35) v2(27.22,94.18) v2(28.02,97.65) v2(28.02,96.48) v2(28.02,95.32) v2(28.02,94.15) v2(28.86,97.64) v2(28.86,96.48) v2(28.86,95.31) v2(28.86,94.14)
VOUT2: length 3.8
  Top Layer w0.508: R36.2 4.19,25.59 R41.2 ; R45.2 20.32,36.26 v2(20.32,37.77)
  vias: v2(25.07,50.83) v2(25.07,49.63) v2(25.07,48.46) v2(25.07,47.33) v2(25.91,50.83) v2(25.91,49.63) v2(25.91,48.46) v2(25.91,47.33) v2(26.72,50.83) v2(26.72,49.63) v2(26.72,48.46) v2(26.72,47.33) v2(27.56,50.83) v2(27.56,49.63) v2(27.56,48.46) v2(27.56,47.33)
VOUT3: length 5.2
  Top Layer w0.508: v2(78.25,67.74) 79.01,67.74 79.52,67.23 79.52,65.96 ; R25.2 97.77,77.65 R20.2
  vias: v2(73.81,57.05) v2(73.81,55.84) v2(73.81,54.67) v2(73.81,53.55) v2(74.65,57.05) v2(74.65,55.84) v2(74.65,54.67) v2(74.65,53.55) v2(75.46,57.05) v2(75.46,55.84) v2(75.46,54.67) v2(75.46,53.55) v2(76.3,57.05) v2(76.3,55.84) v2(76.3,54.67) v2(76.3,53.55)
VOUT4: length 4.8
  Top Layer w0.508: v2(78.1,19.74) 78.61,19.74 79.14,19.21 R61.2 ; R52.2 95.88,30.51 R57.2
  vias: v2(72.8,8.28) v2(72.8,7.07) v2(72.8,5.91) v2(72.8,4.78) v2(73.64,8.28) v2(73.64,7.07) v2(73.64,5.91) v2(73.64,4.78) v2(74.44,8.28) v2(74.44,7.07) v2(74.44,5.91) v2(74.44,4.78) v2(75.28,8.28) v2(75.28,7.07) v2(75.28,5.91) v2(75.28,4.78)
$1N587: length 4.5
  Top Layer w0.508: C2.2 10.49,84.81 10.8,84.51 10.8,83.36 10.92,83.24 U1.4
$1N613: length 14.8
  Top Layer w0.508: Q2.1 13.97,72.27 13.97,80.57 13.84,80.7 U1.6 11.05,80.7 10.87,80.88 10.87,82.15 10.54,82.47 9.17,82.47 C3.2
$1N810: length 5.9
  Top Layer w0.508: C5.2 7,80.06 10.92,80.06 11.05,79.93 11.05,79.55 11.18,79.43 U1.7
$1N1003: length 2.4
  Top Layer w0.508: C5.1 6.98,76.01 R1.1
$1N1020: length 7.4
  Top Layer w0.508: R3.2 14.24,89.05 14.22,89.03 14.22,86.28 13.72,85.78 U1.2
$1N1118: length 5.8
  Top Layer w0.508: R4.1 18.16,70.66 17.65,70.16 16.26,70.16 15.94,70.47 Q2.2
$1N1194: length 9.4
  Top Layer w0.508: U1.9 16.64,78.16 16.13,77.65 16.13,74.85 16.78,74.2 R4.2 20.45,74.2 R5.1
$1N1234: length 23.2
  Top Layer w0.508: D1.1 25.02,82.6 24.77,82.35 24.77,80.97 R7.1 24.78,79.31 24.38,78.92 20.83,78.92 20.34,79.41 C9.2 20.38,80.49 20.38,81.52 19.94,81.97 U1.12 16.64,81.97 16.21,82.4 R2.2
$1N1468: length 8.5
  Top Layer w0.508: D1.2 24.99,88.06 20.7,88.06 20.19,87.55 20.19,86.79 19.18,85.78 U1.15
$1N1730: length 1.9
  Top Layer w0.508: R9.2 24.61,90.6 D4.1
$1N2143: length 9.8
  Top Layer w0.508: U1.16 19.18,87.05 19.56,87.43 19.56,90.22 19.94,90.6 R9.1 20.84,92.14 21.34,92.63 R8.1
$1N2257: length 25.9
  Top Layer w0.508: D4.2 27.05,90.5 27.05,92.13 26.54,92.63 R8.2 24.88,98.33 25.72,99.17 37.53,99.17 37.97,98.73 37.97,98.22 37.54,97.79 Q3.4
$1N2454: length 19.3
  Top Layer w0.508: U1.14 18.94,84.51 19.73,85.29 19.73,85.31 20.46,86.05 C6.1
  Top Layer w1.016: C6.1 21.61,86.03 26.42,86.03 28.45,88.06 30.99,88.06 31.81,87.24 L2.1
$1N2537: length 2.4
  Top Layer w0.508: R10.1 20.08,83.24 U1.13
$1N2739: length 14.7
  Top Layer w0.508: R11.2 28.1,74.52 D5.2 v2(28.1,78.28) ; v2(28.1,68.63) Q4.4
  Bottom Layer w0.508: v2(28.1,78.28) v2(28.1,68.63)
$1N2745: length 11.9
  Top Layer w0.508: 25.8,74.35 24.51,74.35 24.38,74.47 24.38,75.23 24,75.62 22.48,75.62 22.1,76 22.1,77 R12.1 20.07,77.01 19.56,77.52 19.56,78.92 19.05,79.43 U1.10
$1N2749: length 1.6
  Top Layer w0.508: R12.2 D5.1
$1N3054: length 3
  Top Layer w0.508: R13.1 4.95,73.06 C12.2
$1N3114: length 15.3
  Top Layer w0.508: R14.1 C12.1 R16.2 ; R16.2 9.92,74.46 9.78,74.6 9.4,74.6 9.25,74.74 R1.2 9.25,76.62 9.65,77.01 C4.1 9.76,78.16 U1.8 ; R16.2 R15.2
$1N10505: length 18.9
  Top Layer w0.508: C16.1 81.77,63.66 83.06,64.95 U6.14
  Top Layer w1.27: C16.1 69.68,63.66 L3.1
$1N10518: length 23.9
  Top Layer w0.508: R27.2 80,56.66 D7.2 77.85,51.49 77.09,50.72 65.66,50.72 65.02,51.36 65.02,52.88 65.19,53.05 Q6.4
$1N10523: length 2.3
  Top Layer w0.508: R22.2 79.67,59.01 D7.1
$1N10529: length 21.6
  Top Layer w0.508: R32.2 86.54,67.06 86.11,67.49 U6.12 80.39,67.49 79.38,68.5 79.38,69.63 C24.2 R30.1 ; 77.07,68.89 77.07,65.63 D6.1
$1N10537: length 2.5
  Top Layer w0.508: R25.1 97.65,75.49 C23.2
$1N10539: length 2.7
  Top Layer w0.508: 81.52,65.96 81.77,66.22 84.1,66.22
$1N10542: length 2.5
  Top Layer w0.508: R24.2 78.82,77.84 R17.2
$1N10551: length 37.5
  Top Layer w0.508: R28.2 79.36,75.14 D8.2 v2(70.99,75.14) ; Q7.4 72.77,80.31 73.03,80.57 73.03,81.97 72.67,82.33 62.46,82.33 61.85,81.71 v2(61.85,80.31)
  Bottom Layer w0.508: v2(70.99,75.14) 70.96,75.11 68.45,75.11 66.8,76.76 62.87,76.76 61.85,77.78 v2(61.85,80.31)
$1N10557: length 7.1
  Top Layer w0.508: R28.1 81.39,72.08 82.68,70.78 82.71,70.78 83.41,70.08 83.41,70.06 83.44,70.03 U6.10
$1N10562: length 2.6
  Top Layer w0.508: D8.1 76.93,72.69 R23.2
$1N10564: length 9.8
  Top Layer w0.508: 81.01,77.9 81.14,77.78 R19.2 82.82,71.92 83.44,71.3 U6.9
$1N10568: length 17.4
  Top Layer w0.508: C22.1 94.12,69.94 R18.2 ; U6.8 91.44,71.3 92.58,72.44 R18.2 ; R18.2 94.12,73.44 93.34,74.22 93.34,75.47 C23.1 R20.1 88.53,77.65 R26.2
$1N10586: length 7.8
  Top Layer w0.508: U6.16 83.69,62.41 83.19,61.9 83.19,59.74 82.8,59.36 R22.1 R27.1
$1N10591: length 8.5
  Top Layer w0.508: U6.15 83.19,63.68 82.3,62.79 82.3,62.03 81.93,61.66 C16.2 80.47,61.49 77.47,61.49
$1N10609: length 3
  Top Layer w0.508: Q5.2 84.9,77.69 R19.1
$1N10613: length 8.6
  Top Layer w0.508: U6.7 92.07,70.03 92.58,69.52 92.58,68.5 93.18,67.9 C22.2 97.21,67.9 C18.2
$1N10618: length 7.7
  Top Layer w0.508: C20.2 94.54,62.28 92.84,62.28 92.07,63.04 92.07,65.84 91.69,66.22 U6.4
$1N10620: length 15.2
  Top Layer w0.508: C19.2 93.71,65.22 91.95,66.98 91.95,68.38 91.57,68.76 U6.6 88.39,68.76 86.8,70.35 Q5.1
$1N10634: length 8
  Top Layer w0.508: U6.2 88.77,63.68 88.47,63.37 R32.1 88.5,59.83 R31.2
$1N10636: length 3.6
  Top Layer w0.508: C18.1 97.25,72.22 97.03,72.44 R18.1
$1N12142: length 6.5
  Top Layer w0.508: U8.16 16.51,41.71 17.14,42.34 R38.1 19.81,44.01 R43.1
$1N12147: length 17.7
  Top Layer w0.508: C26.1 19.16,39.17 U8.14
  Top Layer w1.016: C26.1 26.91,39.18 27.31,38.79 27.31,36.94 27.81,36.44 30.06,36.44 30.42,36.8 30.42,36.94
$1N12160: length 25.6
  Top Layer w0.508: 34.48,50.85 34.5,50.87 35.96,50.87 36.32,51.23 36.32,51.99 35.62,52.69 23.05,52.69 21.97,51.61 21.97,46.05 D10.2 22,44.17 R43.2
$1N12165: length 2.5
  Top Layer w0.508: D10.1 19.64,46.01 R38.2
$1N12167: length 14.8
  Top Layer w0.508: C29.2 8,37.26 8.25,37.01 8.25,36.92 8.25,36.91 8.25,36.34 8.25,36.34 8.25,35.48 8.38,35.36 U8.6 12.06,35.36 12.83,34.59 12.83,30.4 13.27,29.96 Q8.1
$1N12177: length 8
  Top Layer w0.508: D9.2 19.26,41.1 C26.2 18.18,41.18 18.16,41.2 17.65,41.2 16.89,40.44 U8.15
$1N12195: length 5.1
  Top Layer w0.508: U8.4 8.38,37.9 8,38.28 8,39.67 7.62,40.06 6.33,40.06 C30.2
$1N12199: length 2.4
  Top Layer w0.508: R41.1 3.94,27.59 C33.2
$1N12201: length 4.5
  Top Layer w0.508: U8.13 15.24,37.88 17.78,37.88 18.14,37.52 18.29,37.52 18.29,36.26 R45.1
$1N12204: length 25.3
  Top Layer w0.508: 22.86,36.6 22.86,33.03 22.88,33.01 ; R48.2 13.46,43.82 13.46,37.01 13.84,36.63 U8.12 16.51,36.63 16.89,36.25 16.89,35.1 17.14,34.85 18.16,34.85 18.52,34.49 18.43,34.4 C34.2 18.43,32.29 18.92,31.8 22.35,31.8 22.88,32.33 22.88,33.01 ; 22.88,33.01 R46.1
$1N12212: length 7
  Top Layer w0.508: U8.7 8.38,34.09 7.49,34.98 3.1,34.98 C28.2
$1N12217: length 17
  Top Layer w0.508: R34.2 R37.2 R42.2 ; R36.1 C33.1 6.12,27.95 C32.1 6.27,32.82 U8.8
$1N12230: length 11.5
  Top Layer w0.508: R44.2 20.91,27.88 D11.2 v2(20.93,26.72) ; v2(24,22.91) 25.57,22.91 25.63,22.97
  Bottom Layer w0.508: v2(24,22.91) 21.46,22.91 20.93,23.45 v2(20.93,26.72)
$1N12236: length 2.1
  Top Layer w0.508: D11.1 23.27,29.85 R39.2
$1N12238: length 9.5
  Top Layer w0.508: U8.10 16.38,34.09 17.27,33.2 17.27,30.28 17.67,29.88 R44.1 18.81,29.9 R39.1
$1N12243: length 3.2
  Top Layer w0.508: C28.1 3.08,31 3.3,30.78 R34.1
$1N12250: length 3.2
  Top Layer w0.508: R35.1 15.17,25.37 Q8.2
$1N12252: length 11.6
  Top Layer w0.508: U8.9 16.38,32.82 16.64,32.56 16.64,27.1 17.14,26.59 17.14,25.34 R35.2 R40.1
$1N12258: length 7.3
  Top Layer w0.508: U8.2 11.05,40.44 11.43,40.82 11.43,43.88 11.45,43.9 ; R47.2 11.45,43.9 ; 11.45,43.9 R48.1
$1N13775: length 8.5
  Top Layer w0.508: R54.1 80.99,8.32 R59.1 81.92,11.36 82.55,11.99 82.55,13.77 82.93,14.15 U10.16
$1N13780: length 18.7
  Top Layer w0.508: U10.14 82.68,16.69 81.9,15.91 C36.1
  Top Layer w1.27: C36.1 73.55,15.91 71.37,18.09 L5.1
$1N13793: length 25.5
  Top Layer w0.508: R59.2 76.79,11.36 D13.2 v2(72.9,11.26) ; v2(64.26,2.34) 64.26,4.24 64.64,4.62 Q12.4
  Bottom Layer w0.508: v2(72.9,11.26) 71.15,11.26 69.85,9.96 69.85,3.99 68.2,2.34 v2(64.26,2.34)
$1N13798: length 6.6
  Top Layer w0.508: R54.2 79.01,6.67 78.49,6.15 77.22,6.15 76.71,6.66 76.71,8.9 D13.1
$1N13800: length 18
  Top Layer w0.508: C39.2 92.2,18.21 91.44,18.97 91.44,19.99 90.93,20.5 U10.6 88.52,20.5 88.01,21.01 88.01,22.66 86.29,24.37 Q11.1
$1N13810: length 8.6
  Top Layer w0.508: D12.2 80.85,13.87 C36.2 81.83,13.91 82.19,14.28 82.19,15.06 82.55,15.42 U10.15
$1N13828: length 5.7
  Top Layer w0.508: U10.4 91.21,17.96 91.59,17.58 91.59,16.16 91.95,15.8 C40.2
$1N13832: length 2.4
  Top Layer w0.508: C43.2 97.9,28.5 R57.1
$1N13834: length 3.2
  Top Layer w0.508: R61.1 81.39,17.96 U10.13
$1N13837: length 21.4
  Top Layer w0.508: R64.2 86.03,18.8 85.6,19.23 U10.12 82.42,19.23 81.43,20.22 79.63,20.22 79.27,20.58 79.27,21.13 79.14,21.26 76.69,21.26 76.69,18 D12.1
$1N13845: length 6.8
  Top Layer w0.508: C38.2 C42.2 92.57,20.77 91.57,21.77 U10.7
$1N13850: length 16.8
  Top Layer w0.508: R52.1 C43.1 R50.2 ; R53.2 88.66,25.58 R50.2 ; R50.2 93.49,22.78 C42.1 93.2,23.04 U10.8
$1N13863: length 15.8
  Top Layer w0.508: v2(72.52,24.31) 72.54,24.33 D14.2 77.75,24.24 R60.2 ; Q13.4 72.49,31.57 v2(72.52,31.55)
  Bottom Layer w0.508: v2(72.52,24.31) v2(72.52,31.55)
$1N13869: length 2
  Top Layer w0.508: D14.1 79.48,26.68 R55.2
$1N13871: length 6.8
  Top Layer w0.508: U10.10 83.06,21.77 81.57,23.25 R60.1 R55.1
$1N13876: length 3.1
  Top Layer w0.508: R50.1 95.49,24.32 96.14,23.67 C38.1
$1N13883: length 3.7
  Top Layer w0.508: R51.1 81.68,31.8 84.2,31.8 84.39,31.61 Q11.2
$1N13885: length 11
  Top Layer w0.508: R56.1 R51.2 81.66,28.5 82.29,27.87 82.31,27.87 82.7,27.48 82.7,23.4 83.06,23.04 U10.9
$1N13891: length 8.4
  Top Layer w0.508: U10.2 88.39,15.42 87.96,14.99 R64.1 88,11.32 R63.2
$1N22659: length 2.2
  Bottom Layer w0.254: 17.4,66.23 LED1.1
$1N22712: length 2.5
  Bottom Layer w0.254: LED2.1 19.73,15.85 R66.2
$1N22765: length 2.5
  Bottom Layer w0.254: R67.2 LED4.1
$1N22818: length 4
  Bottom Layer w0.254: 83.06,84.63 83.06,82.47 82.63,82.05 R68.2

## Copper pours and planes (outline as drawn; the poured copper is in the pictures)
+16.8V on Top Layer: 51.56,86.92 59.44,86.92 60.71,85.65 60.71,4.12 58.67,2.08 52.32,2.08 50.29,4.12 50.29,85.65
+16.8V on Top Layer: 50.32,34.21 37.47,34.21 37.21,33.96 37.21,29.64 41.78,25.07 41.78,3.86 43.56,2.08 52.58,2.08 52.58,31.95
+16.8V on Top Layer: 37.72,50.98 37.13,50.39 37.13,27.37 37.57,26.85 40.45,26.85 41.15,27.55 41.15,31.8 43.81,34.47 44.7,34.47 43.18,35.99 43.18,49.87 42.07,50.98
+16.8V on Top Layer: 50.29,38.15 52.45,38.15 52.71,37.9 52.71,35.1 51.18,33.58 37.47,33.58 37.21,33.83 37.21,37.39 37.72,37.9 40.77,37.9 41.02,37.64 41.02,35.36 41.66,34.72 49.4,34.72 50.29,35.61
+16.8V on Top Layer: 38.35,74.35 39.12,73.58 40.89,73.58 41.66,74.35 41.66,91.62 42.38,92.35 48.67,92.35 50.29,90.73 50.29,85.39 50.67,85.01 52.32,86.67 56.51,86.67 54.61,88.57 54.61,97.84 53.09,99.37 40.26,99.37 38.35,97.46
+16.8V on Bottom Layer: 50.29,86.41 51.18,87.3 56.9,87.3 60.36,83.83 60.36,39.59 57.15,36.37 51.05,36.37 50.29,35.61
+16.8V on Bottom Layer: 57.28,68.89 58.29,67.87 60.12,67.87 60.71,67.29 60.71,64.69 59.82,63.81 57.91,63.81 57.28,63.17
+16.8V on Bottom Layer: 50.29,38.91 58.67,38.91 59.18,38.41 59.18,30.52 60.07,29.63 60.07,4.37 57.78,2.08 52.45,2.08 50.29,4.24
GND on Top Layer: 62.23,101.91 101.98,101.91 101.98,79.17 62.23,79.17
GND on Top Layer: 44.54,86.79 48.77,86.79 49.53,86.03 49.53,36.49 48.89,35.85 44.46,35.85 43.94,36.37 43.94,86.19
GND on Top Layer: 1.14,69.39 45.47,69.39 45.47,54.66 1.14,54.66
GND on Top Layer: -2.79,21.39 40.77,21.39 40.77,-4.9 -2.79,-4.9
GND on Top Layer: 83.57,12.24 100.97,12.24 100.97,-2.74 83.57,-2.74
GND on Top Layer: 63.37,49.45 99.19,49.45 99.19,34.72 63.37,34.72
GND on Bottom Layer: 49.15,35.23 49.78,35.86 49.78,84.63 48.01,86.41 44.45,86.41 42.93,84.89 42.93,65.33 39.88,62.28 7.87,62.28 6.48,63.68 6.48,92 6.1,92.38 1.52,92.38 1.03,91.89 1.03,54.52 3.3,52.25 42.04,52.25 43.81,50.47 43.81,36.56 45.14,35.23
GND on Bottom Layer: -4.57,111.18 107.7,111.18 107.7,-9.6 -4.57,-9.6
GND on Bottom Layer: 14.64,57.5 2.71,57.5 1.07,55.85 1.07,8.71 2.03,7.75 38.56,7.75 40,9.19 40,12.02 38.06,13.97 12.24,13.97 7.75,18.47 7.75,50.61
GND on Bottom Layer: 42.93,99.49 42.29,98.86 42.29,89.46 43.69,88.06 63.37,88.06 63.37,99.11 62.99,99.49
VOUT1 on Top Layer: 5.82,72.06 6.22,71.65 6.22,69.27 7.37,68.12 14.73,68.12 15.37,67.49 15.37,62.66 14.86,62.15 5.97,62.15 4.95,63.17 4.95,68.63 4.7,68.89 1.02,68.89 0.76,69.14 0.76,71.93 0.89,72.06
VOUT1 on Top Layer: 26.16,98.48 35.05,98.48 35.18,98.35 35.18,93.4 35.05,93.27 26.16,93.27 25.65,93.78 25.65,97.97
VOUT1 on Bottom Layer: 23.61,98.33 30.34,98.33 30.86,97.82 30.86,93.96 30.5,93.52 28.7,93.52 26.56,91.38 26.56,68.24 27.69,67.11 29.08,67.11 29.71,67.74 29.71,69.01 30.35,69.65 38.1,69.65 39.24,68.5 39.24,64.06 38.1,62.92 8.76,62.92 8.13,63.55 8.13,65.71 9.53,67.11 14.22,67.11 14.99,67.87 14.99,74.73 17.14,76.89 20.95,76.89 22.64,78.57 22.64,97.36
VOUT2 on Top Layer: 0.84,26.34 4.7,26.34 4.83,26.21 4.83,24.18 5.33,23.67 11.18,23.67 15.88,18.97 15.88,15.63 14.64,14.4 10.11,14.4 9.6,14.91 9.6,20.04 7.87,21.77 1.4,21.77 0.62,22.55 0.62,26.12
VOUT2 on Top Layer: 24.64,51.74 33.14,51.74 33.5,51.39 33.5,45.61 32.77,44.88 25.27,44.88 24.38,45.77 24.38,51.49
VOUT2 on Bottom Layer: 28.32,51.36 28.57,51.11 28.57,36.37 28.19,35.99 20.7,35.99 19.81,35.1 19.81,23.67 21.59,21.9 39.24,21.9 40,21.13 40,15.16 39.5,14.66 12.92,14.66 8.86,18.72 8.86,24.02 15.25,30.42 15.25,49.72 16.89,51.36
VOUT3 on Top Layer: 84.96,85.01 92.46,85.01 94.36,83.11 94.36,80.44 95.76,79.05 98.43,79.05 99.06,78.41 99.06,77.14 98.81,76.89 94.74,76.89 94.62,77.01 94.62,78.41 94.23,78.79 85.34,78.79 84.71,79.43 84.71,84.76
VOUT3 on Top Layer: 67.82,57.97 76.19,57.97 76.84,57.33 76.84,52.76 76.33,52.25 67.69,52.25 67.56,52.38 67.56,57.71
VOUT3 on Bottom Layer: 64.77,85.65 62.87,83.74 62.87,78.28 63.5,77.65 71.37,77.65 73.03,76 73.03,52.63 74.42,51.23 81.41,51.23 82.77,52.6 82.77,77.74 84.33,79.3 90.55,79.3 91.19,79.93 91.19,84.89 90.42,85.65
VOUT4 on Top Layer: 85.34,41.07 90.3,41.07 90.81,40.56 90.81,37.52 91.31,37.01 94.11,37.01 97.66,33.45 98.68,33.45 99.31,32.82 99.31,30.4 98.81,29.9 95.12,29.9 94.74,30.28 94.74,32.94 94.23,33.45 86.36,33.45 84.84,34.98 84.84,40.56
VOUT4 on Top Layer: 66.93,9.25 75.26,9.25 75.82,8.69 75.82,4.62 75.18,3.99 66.8,3.99 66.68,4.12 66.68,8.99
VOUT4 on Bottom Layer: 72.26,9.45 71.91,9.1 71.91,4.59 72.52,3.99 78.1,3.99 78.84,4.72 78.84,32.79 79.88,33.83 90.68,33.83 91.69,34.85 91.69,41.07 90.93,41.83 60.96,41.83 59.69,40.56 59.69,31.04 59.94,30.78 73.22,30.78 74.17,29.83 74.17,9.83 73.79,9.45
$1N1198 on Top Layer: 21.46,74.75 23.6,74.75 23.75,74.6 23.75,73.58 24.38,72.95 29.72,72.95 29.84,72.82 29.84,69.52 29.72,69.39 24.26,69.39 23.5,70.16 21.37,70.16 21.12,70.41 21.12,74.41
$1N2454 on Top Layer: 36.83,96.95 36.96,96.83 36.96,91.87 36.07,90.98 33.66,90.98 33.15,90.47 33.15,74.98 33.53,74.6 35.82,74.6 36.07,74.35 36.07,68.25 35.69,67.87 30.35,67.87 30.1,68.12 30.1,92 30.61,92.51 34.8,92.51 35.43,93.14 35.43,96.83 35.56,96.95
$1N10505 on Top Layer: 64.31,81.03 69.65,81.03 69.98,80.7 69.98,66.09 67.18,63.3 67.18,53.9 67.06,53.77 65.89,53.77 65.79,53.98 65.79,74.85 65.41,75.23 64.64,75.23 64.13,75.74 64.13,80.85
$1N10542 on Top Layer: 77.09,79.43 77.47,79.05 77.47,76.38 77.22,76.12 70.61,76.12 70.49,76.25 70.49,79.35 70.56,79.43
$1N12147 on Top Layer: 35.05,49.96 35.18,49.83 35.18,44.25 34.67,43.74 32,43.74 31.62,43.36 31.62,28.25 32,27.86 32.64,27.86 32.89,27.61 32.89,22.4 32.64,22.15 26.8,22.15 26.67,22.28 26.67,43.87 27.31,44.5 33.15,44.5 33.78,45.14 33.78,49.83 33.91,49.96
$1N12190 on Top Layer: 26.03,27.48 26.29,27.23 26.29,23.93 26.03,23.67 23.37,23.67 23.24,23.55 23.24,22.66 22.86,22.28 20.83,22.28 20.7,22.4 20.7,25.94 20.83,26.06 24.36,26.06 24.51,26.21 24.51,27.36 24.64,27.48
$1N13780 on Top Layer: 64.9,32.69 69.47,32.69 70.1,32.06 70.1,11.05 68.5,9.44 66.67,9.44 66.42,9.19 66.42,5.48 66.36,5.41 65.12,5.41 65.02,5.51 65.02,8.94 65.53,9.45 65.53,26.47 64.52,27.48 64.52,32.31
$1N13823 on Top Layer: 70.49,30.78 72.52,30.78 73.53,29.77 75.18,29.77 76.2,30.78 76.2,32.44 76.58,32.82 79.88,32.82 80.04,32.66 80.04,31.32 79.76,31.04 78.23,31.04 76.58,29.39 76.58,28.12 75.69,27.23 70.61,27.23 70.36,27.48 70.36,30.66

Small or netless copper shapes (teardrops, artwork), in the pictures only: 416 on Top Layer, 38 on Bottom Layer

## Text on the board
Bottom Silkscreen Layer: RoboPioneers / @LC / 2025/3/30 | 机甲杯正赛 / 24V升压电源板
